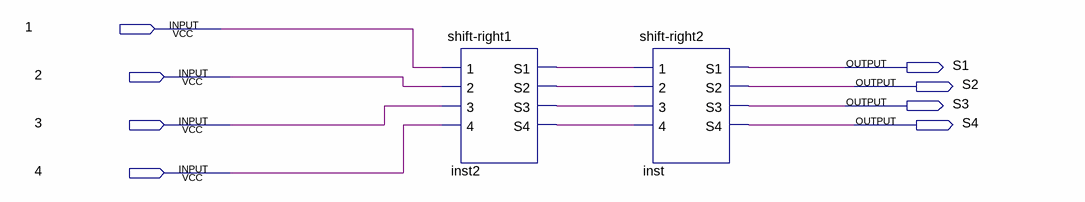
[diagram p0: schematic sheet]
// Quartus schematic shift-right3.bdf as structural Verilog: 2 symbols, 8 pins
module \shift-right3  (
  input  \1 ,
  input  \2 ,
  input  \3 ,
  input  \4 ,
  output S1,
  output S2,
  output S3,
  output S4
);

  wire inst2_s1, inst2_s2, inst2_s3, inst2_s4;

  \shift-right1  inst2 (
    .\1 (\1 ), .\2 (\2 ), .\3 (\3 ), .\4 (\4 ), .S1(inst2_s1), .S2(inst2_s2), .S3(inst2_s3), .S4(inst2_s4));
  \shift-right2  inst (
    .\1 (inst2_s1), .\2 (inst2_s2), .\3 (inst2_s3), .\4 (inst2_s4), .S1(S1), .S2(S2), .S3(S3), .S4(S4));
endmodule
